# Altium schematic sheet micron_P2.SchDoc
size A; SheetNumber: 2; SheetTotal: 11
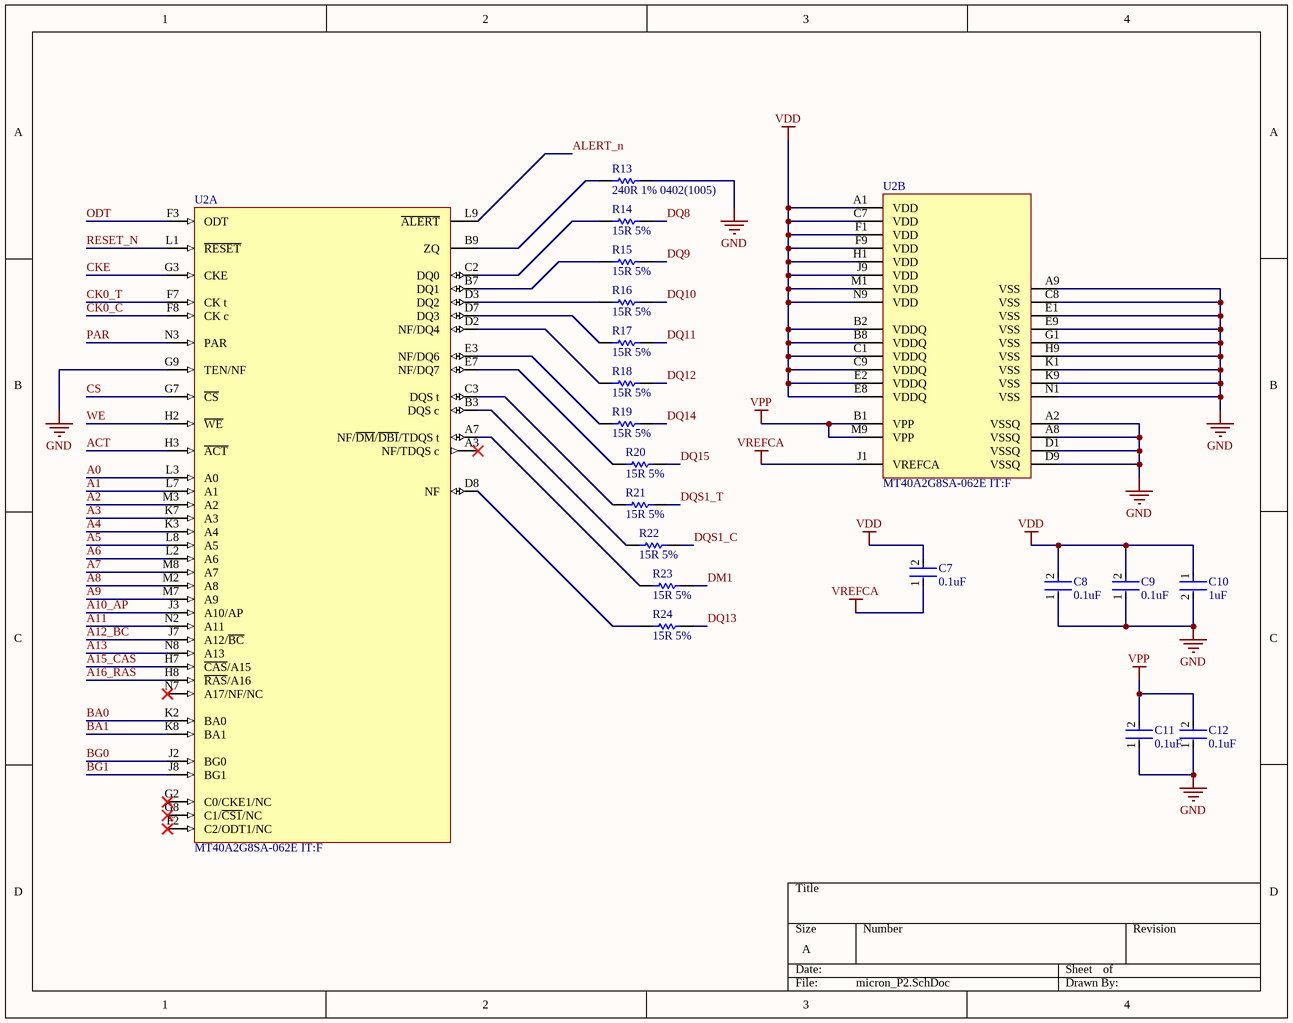
[diagram p0: micron_P2.SchDoc]

## Parts
C7  0.1uF  [FP-GRM15-MFG]
C8  0.1uF  [FP-GRM15-MFG]
C9  0.1uF  [FP-GRM15-MFG]
C10  1uF  [FP-CL511-IPC_C]
C11  0.1uF  [FP-GRM15-MFG]
C12  0.1uF  [FP-GRM15-MFG]
R13  240R 1% 0402(1005)  [RESC0402(1005)_L]
R14  15R 5%  [RESC1005X40X25LL05T10]
R15  15R 5%  [RESC1005X40X25LL05T10]
R16  15R 5%  [RESC1005X40X25LL05T10]
R17  15R 5%  [RESC1005X40X25LL05T10]
R18  15R 5%  [RESC1005X40X25LL05T10]
R19  15R 5%  [RESC1005X40X25LL05T10]
R20  15R 5%  [RESC1005X40X25LL05T10]
R21  15R 5%  [RESC1005X40X25LL05T10]
R22  15R 5%  [RESC1005X40X25LL05T10]
R23  15R 5%  [RESC1005X40X25LL05T10]
R24  15R 5%  [RESC1005X40X25LL05T10]
U2  MT40A2G8SA-062E IT:F  [SA_MFG]  (parts A,B of 2)

## Nets
GND: C8.1 C9.1 C10.2 C11.1 C12.1 R13.2 U2.A2(VSSQ) U2.A8(VSSQ) U2.A9(VSS) U2.C8(VSS) U2.D1(VSSQ) U2.D9(VSSQ) U2.E1(VSS) U2.E9(VSS) U2.G1(VSS) U2.G9(TEN/NF) U2.H9(VSS) U2.K1(VSS) U2.K9(VSS) U2.N1(VSS)
VDD: C7.2 C8.2 C9.2 C10.1 U2.A1(VDD) U2.B2(VDDQ) U2.B8(VDDQ) U2.C1(VDDQ) U2.C7(VDD) U2.C9(VDDQ) U2.E2(VDDQ) U2.E8(VDDQ) U2.F1(VDD) U2.F9(VDD) U2.H1(VDD) U2.J9(VDD) U2.M1(VDD) U2.N9(VDD)
VPP: C11.2 C12.2 U2.B1(VPP) U2.M9(VPP)
VREFCA: C7.1 U2.J1(VREFCA)
A0: U2.L3(A0)
A1: U2.L7(A1)
A2: U2.M3(A2)
A3: U2.K7(A3)
A4: U2.K3(A4)
A5: U2.L8(A5)
A6: U2.L2(A6)
A7: U2.M8(A7)
A8: U2.M2(A8)
A9: U2.M7(A9)
A10_AP: U2.J3(A10/AP)
A11: U2.N2(A11)
A12_BC: U2.J7(A12/~{BC})
A13: U2.N8(A13)
A15_CAS: U2.H7(~{CAS}/A15)
A16_RAS: U2.H8(~{RAS}/A16)
ACT: U2.H3(~{ACT})
ALERT_n: U2.L9(~{ALERT})
BA0: U2.K2(BA0)
BA1: U2.K8(BA1)
BG0: U2.J2(BG0)
BG1: U2.J8(BG1)
CK0_C: U2.F8(CK_c)
CK0_T: U2.F7(CK_t)
CKE: U2.G3(CKE)
CS: U2.G7(~{CS})
DM1: R23.2
DQ8: R14.2
DQ9: R15.2
DQ10: R16.2
DQ11: R17.2
DQ12: R18.2
DQ13: R24.2
DQ14: R19.2
DQ15: R20.2
DQS1_C: R22.2
DQS1_T: R21.2
ODT: U2.F3(ODT)
PAR: U2.N3(PAR)
RESET_N: U2.L1(~{RESET})
WE: U2.H2(~{WE})
NetR13_1: R13.1 U2.B9(ZQ)
NetR14_1: R14.1 U2.C2(DQ0)
NetR15_1: R15.1 U2.B7(DQ1)
NetR16_1: R16.1 U2.D3(DQ2)
NetR17_1: R17.1 U2.D7(DQ3)
NetR18_1: R18.1 U2.D2(NF/DQ4)
NetR19_1: R19.1 U2.E3(NF/DQ6)
NetR20_1: R20.1 U2.E7(NF/DQ7)
NetR21_1: R21.1 U2.C3(DQS_t)
NetR22_1: R22.1 U2.B3(DQS_c)
NetR23_1: R23.1 U2.A7(NF/~{DM}/~{DBI}/TDQS_t)
NetR24_1: R24.1 U2.D8(NF)

Not connected (* = marked no-connect by the designer): U2 A3(NF/TDQS_c)* F2(C2/ODT1/NC)* G2(C0/CKE1/NC)* G8(C1/~{CS1}/NC)* N7(A17/NF/NC)*

## Library data of the parts
C7-C9 C11 C12 = CMP-2100-03641-2: CAP CER 0.1UF 16V X7R 0402; Manufacturer Part Number: GRM155R71C104KA88D; Manufacturer: Murata; Standoff Height: 0mm; Tolerance: 10%; Voltage Rating: 16Vdc; Material: Ceramic; Capacitance: 0.10μF; Value: 0.10μF; RoHS: TRUE; Temperature Characteristic: X7R; Octopart: https://octopart.com/grm155r71c104ka88d-murata-196880; Digikey Description: CAP CER 0.1UF 16V X7R 0402; Device Class L3: Ceramic Capacitors; Height: 0.55mm; ComponentLink2Description: Datasheet; Temperature Range Low: -55°C; Ipc Land Pattern Name: CAPC10050X219; ComponentLink2URL: https://search.murata.co.jp/Ceramy/image/img/A01X/G101/ENG/GRM155R71H471KA01-01A.pdf; Device Class L1: Passive Components; Lead Free: yes; Category: Cap; Package: GRM15; Temperature: -55°C to +125°C; Device Class L2: Capacitors; Temperature Range High: +125°C; Mouser Description: 0402 0.1 uF 16V ±10 % Tolerance X7R SMT Multilayer Ceramic Capacitor
C10 = CMP-13271-001936-1: Cap Ceramic 1uF 10V X5R ±10% SMD 0402 +85°C Paper T/R; Depth: 0.5mm; Case Code (Imperial): 0402; Material: Ceramic; Mount: Surface Mount; Thickness: 0.022inch; Dielectric: X5R; Capacitance: 1uF; Radiation Hardening: No; Case/Package: 0402; Length: 1mm; Tolerance: 10%; Max Operating Temperature: 85°C; Package Quantity: 1; Width: 0.02inch; Voltage Rating: 10V; Contact Plating: Tin; Height: 0.5mm; Min Operating Temperature: -55°C; Case Code (Metric): 1005; Packaging: Tape and Reel
R13 = CMP-1011-00438-1: 240R 0.063W 1% 0402 (1005 Metric)  SMD; Case-Metric: 1005; Case-EIA: 0402; Value: 240.00 Ohm; Power: 0.063 W; Tolerance: 1 %; Technology: SMT
R14-R24 = CMP-2002-07413-1: Manufacturer: Yageo / Phycomp; Part Number: RC0402FR-0715RL
U2 = CMP-00526-125391410-1: DRAMChip DDR4 SDRAM 16Gbit 2Gx8 1.2V 78-Pin FBGA Tray; ComponentLink1URL: http://www.micron.com/; ComponentLink3Description: Manufacturer's Package Drawing; ComponentLink2Description: Datasheet URL; ComponentLink1Description: Manufacturer's Website; ComponentLink3URL: https://www.micron.com/content/dam/micron/global/public/products/customer-service-note/csn33-bga-user-guide.pdf; HelpURL: https://4donline.ihs.com/images/VipMasterIC/IC/MICT/MICT-S-A0014105731/MICT-S-A0014105731-1.pdf?hkey=6D3A4C79FDBF58556ACFDE234799DDF0; ComponentLink2URL: https://4donline.ihs.com/images/VipMasterIC/IC/MICT/MICT-S-A0014105731/MICT-S-A0014105731-1.pdf?hkey=6D3A4C79FDBF58556ACFDE234799DDF0